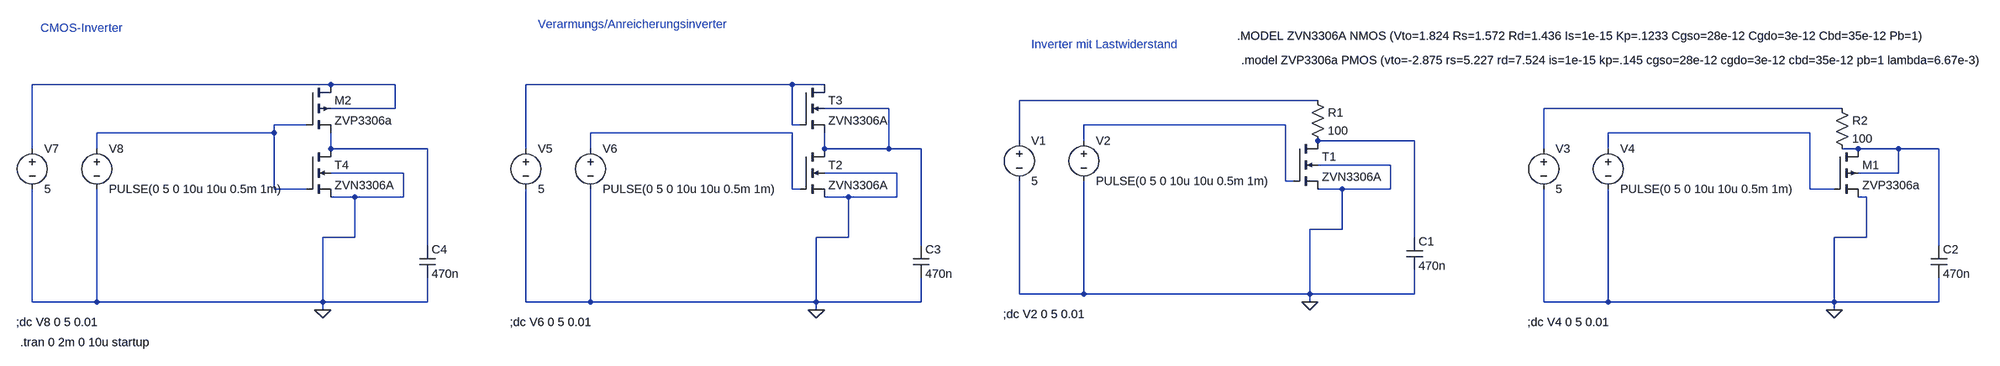
[diagram p0: schematic Draft1.asc]
Draft1.asc, the LTspice schematic file:
Version 4
SHEET 1 1132 680
WIRE -2704 -416 -3296 -416
WIRE -2576 -416 -2704 -416
WIRE -1664 -416 -2192 -416
WIRE -1600 -416 -1664 -416
WIRE -208 -384 -800 -384
WIRE -2576 -368 -2576 -416
WIRE -2576 -368 -2704 -368
WIRE -1472 -368 -1600 -368
WIRE 832 -368 240 -368
WIRE -2752 -336 -2816 -336
WIRE -1664 -336 -1664 -416
WIRE -1648 -336 -1664 -336
WIRE -272 -336 -672 -336
WIRE -2816 -320 -2816 -336
WIRE -2816 -320 -3168 -320
WIRE -1664 -320 -2064 -320
WIRE 768 -320 368 -320
WIRE -800 -304 -800 -384
WIRE -672 -304 -672 -336
WIRE -16 -304 -208 -304
WIRE -3296 -288 -3296 -416
WIRE -3168 -288 -3168 -320
WIRE -2704 -288 -2704 -320
WIRE -2512 -288 -2704 -288
WIRE -2192 -288 -2192 -416
WIRE -2064 -288 -2064 -320
WIRE -1600 -288 -1600 -320
WIRE -1472 -288 -1472 -368
WIRE -1472 -288 -1600 -288
WIRE -1408 -288 -1472 -288
WIRE 240 -288 240 -368
WIRE 368 -288 368 -320
WIRE 864 -288 832 -288
WIRE 944 -288 864 -288
WIRE 1024 -288 944 -288
WIRE -64 -256 -208 -256
WIRE -2560 -240 -2704 -240
WIRE -1456 -240 -1600 -240
WIRE 944 -240 944 -288
WIRE 944 -240 864 -240
WIRE -272 -224 -272 -336
WIRE -256 -224 -272 -224
WIRE -2816 -208 -2816 -320
WIRE -2752 -208 -2816 -208
WIRE -1664 -208 -1664 -320
WIRE -1648 -208 -1664 -208
WIRE -160 -208 -208 -208
WIRE -64 -208 -64 -256
WIRE -64 -208 -160 -208
WIRE 768 -208 768 -320
WIRE 816 -208 768 -208
WIRE -2656 -192 -2704 -192
WIRE -2560 -192 -2560 -240
WIRE -2560 -192 -2656 -192
WIRE -1552 -192 -1600 -192
WIRE -1456 -192 -1456 -240
WIRE -1456 -192 -1552 -192
WIRE 880 -192 864 -192
WIRE -160 -128 -160 -208
WIRE -160 -128 -224 -128
WIRE -2656 -112 -2656 -192
WIRE -2656 -112 -2720 -112
WIRE -1552 -112 -1552 -192
WIRE -1552 -112 -1616 -112
WIRE -16 -112 -16 -304
WIRE 880 -112 880 -192
WIRE 880 -112 816 -112
WIRE -2512 -96 -2512 -288
WIRE -1408 -96 -1408 -288
WIRE 1024 -96 1024 -288
WIRE -800 0 -800 -224
WIRE -672 0 -672 -224
WIRE -672 0 -800 0
WIRE -224 0 -224 -128
WIRE -224 0 -672 0
WIRE -16 0 -16 -48
WIRE -16 0 -224 0
WIRE -3296 16 -3296 -208
WIRE -3168 16 -3168 -208
WIRE -3168 16 -3296 16
WIRE -2720 16 -2720 -112
WIRE -2720 16 -3168 16
WIRE -2512 16 -2512 -32
WIRE -2512 16 -2720 16
WIRE -2192 16 -2192 -208
WIRE -2064 16 -2064 -208
WIRE -2064 16 -2192 16
WIRE -1616 16 -1616 -112
WIRE -1616 16 -2064 16
WIRE -1408 16 -1408 -32
WIRE -1408 16 -1616 16
WIRE -224 16 -224 0
WIRE 240 16 240 -208
WIRE 368 16 368 -208
WIRE 368 16 240 16
WIRE 816 16 816 -112
WIRE 816 16 368 16
WIRE 1024 16 1024 -32
WIRE 1024 16 816 16
WIRE -2720 32 -2720 16
WIRE -1616 32 -1616 16
WIRE 816 32 816 16
FLAG -224 16 0
FLAG 816 32 0
FLAG -1616 32 0
FLAG -2720 32 0
SYMBOL nmos4 -256 -304 R0
SYMATTR InstName T1
SYMATTR Value ZVN3306A
SYMBOL res -224 -400 R0
SYMATTR InstName R1
SYMATTR Value 100
SYMBOL voltage -800 -320 R0
WINDOW 123 0 0 Left 2
WINDOW 39 0 0 Left 2
SYMATTR InstName V1
SYMATTR Value 5
SYMBOL voltage -672 -320 R0
WINDOW 123 0 0 Left 2
WINDOW 39 0 0 Left 2
SYMATTR InstName V2
SYMATTR Value PULSE(0 5 0 10u 10u 0.5m 1m)
SYMBOL cap -32 -112 R0
SYMATTR InstName C1
SYMATTR Value 470n
SYMBOL res 816 -384 R0
SYMATTR InstName R2
SYMATTR Value 100
SYMBOL voltage 240 -304 R0
WINDOW 123 0 0 Left 2
WINDOW 39 0 0 Left 2
SYMATTR InstName V3
SYMATTR Value 5
SYMBOL voltage 368 -304 R0
WINDOW 123 0 0 Left 2
WINDOW 39 0 0 Left 2
SYMATTR InstName V4
SYMATTR Value PULSE(0 5 0 10u 10u 0.5m 1m)
SYMBOL cap 1008 -96 R0
SYMATTR InstName C2
SYMATTR Value 470n
SYMBOL pmos4 816 -288 R0
SYMATTR InstName M1
SYMATTR Value ZVP3306a
SYMBOL nmos4 -1648 -288 R0
SYMATTR InstName T2
SYMATTR Value ZVN3306A
SYMBOL voltage -2192 -304 R0
WINDOW 123 0 0 Left 2
WINDOW 39 0 0 Left 2
SYMATTR InstName V5
SYMATTR Value 5
SYMBOL voltage -2064 -304 R0
WINDOW 123 0 0 Left 2
WINDOW 39 0 0 Left 2
SYMATTR InstName V6
SYMATTR Value PULSE(0 5 0 10u 10u 0.5m 1m)
SYMBOL cap -1424 -96 R0
SYMATTR InstName C3
SYMATTR Value 470n
SYMBOL nmos4 -1648 -416 R0
SYMATTR InstName T3
SYMATTR Value ZVN3306A
SYMBOL nmos4 -2752 -288 R0
SYMATTR InstName T4
SYMATTR Value ZVN3306A
SYMBOL voltage -3296 -304 R0
WINDOW 123 0 0 Left 2
WINDOW 39 0 0 Left 2
SYMATTR InstName V7
SYMATTR Value 5
SYMBOL voltage -3168 -304 R0
WINDOW 123 0 0 Left 2
WINDOW 39 0 0 Left 2
SYMATTR InstName V8
SYMATTR Value PULSE(0 5 0 10u 10u 0.5m 1m)
SYMBOL cap -2528 -96 R0
SYMATTR InstName C4
SYMATTR Value 470n
SYMBOL pmos4 -2752 -416 R0
SYMATTR InstName M2
SYMATTR Value ZVP3306a
TEXT -368 -512 Left 2 !.MODEL ZVN3306A NMOS (Vto=1.824 Rs=1.572 Rd=1.436 Is=1e-15 Kp=.1233 Cgso=28e-12 Cgdo=3e-12 Cbd=35e-12 Pb=1)
TEXT -832 40 Left 2 !;dc V2 0 5 0.01
TEXT -360 -464 Left 2 !.model ZVP3306a PMOS (vto=-2.875 rs=5.227 rd=7.524 is=1e-15 kp=.145 cgso=28e-12 cgdo=3e-12 cbd=35e-12 pb=1 lambda=6.67e-3)
TEXT 208 56 Left 2 !;dc V4 0 5 0.01
TEXT -2224 56 Left 2 !;dc V6 0 5 0.01
TEXT -3328 56 Left 2 !;dc V8 0 5 0.01
TEXT -2168 -536 Left 2 ;Verarmungs/Anreicherungsinverter
TEXT -776 -496 Left 2 ;Inverter mit Lastwiderstand
TEXT -3280 -528 Left 2 ;CMOS-Inverter
TEXT -3320 96 Left 2 !.tran 0 2m 0 10u startup

The netlist it stands for:
* Draft1.asc
M§T1 N010 N007 0 0 ZVN3306A
R1 N003 N010 100
V1 N003 0 5
V2 N007 0 PULSE(0 5 0 10u 10u 0.5m 1m)
C1 N010 0 470n
R2 N005 N012 100
V3 N005 0 5
V4 N009 0 PULSE(0 5 0 10u 10u 0.5m 1m)
C2 N012 0 470n
M1 N012 N009 0 N012 ZVP3306a
M§T2 N004 N008 0 0 ZVN3306A
V5 N002 0 5
V6 N008 0 PULSE(0 5 0 10u 10u 0.5m 1m)
C3 N004 0 470n
M§T3 N002 N002 N004 N004 ZVN3306A
M§T4 N011 N006 0 0 ZVN3306A
V7 N001 0 5
V8 N006 0 PULSE(0 5 0 10u 10u 0.5m 1m)
C4 N011 0 470n
M2 N001 N006 N011 N001 ZVP3306a
.model NMOS NMOS
.model PMOS PMOS
.lib standard.mos
.MODEL ZVN3306A NMOS (Vto=1.824 Rs=1.572 Rd=1.436 Is=1e-15 Kp=.1233 Cgso=28e-12 Cgdo=3e-12 Cbd=35e-12 Pb=1)
;dc V2 0 5 0.01
.model ZVP3306a PMOS (vto=-2.875 rs=5.227 rd=7.524 is=1e-15 kp=.145 cgso=28e-12 cgdo=3e-12 cbd=35e-12 pb=1 lambda=6.67e-3)
;dc V4 0 5 0.01
;dc V6 0 5 0.01
;dc V8 0 5 0.01
* Verarmungs/Anreicherungsinverter
* Inverter mit Lastwiderstand
* CMOS-Inverter
.tran 0 2m 0 10u startup
.backanno
.end